# EasyEDA Pro project ProPrj_LogicCard.epro, schematic Schematic1
Board Name: Board1; Create Date: 2025-10-28; Page Name: LogicCard; Project Name: LogicCard; Schematic Name: Schematic1; Update Date: 2025-11-10; Company: annoyedmilk.ch; Drawn: Annoyedmilk; Page Size: A4; Version: V1.0
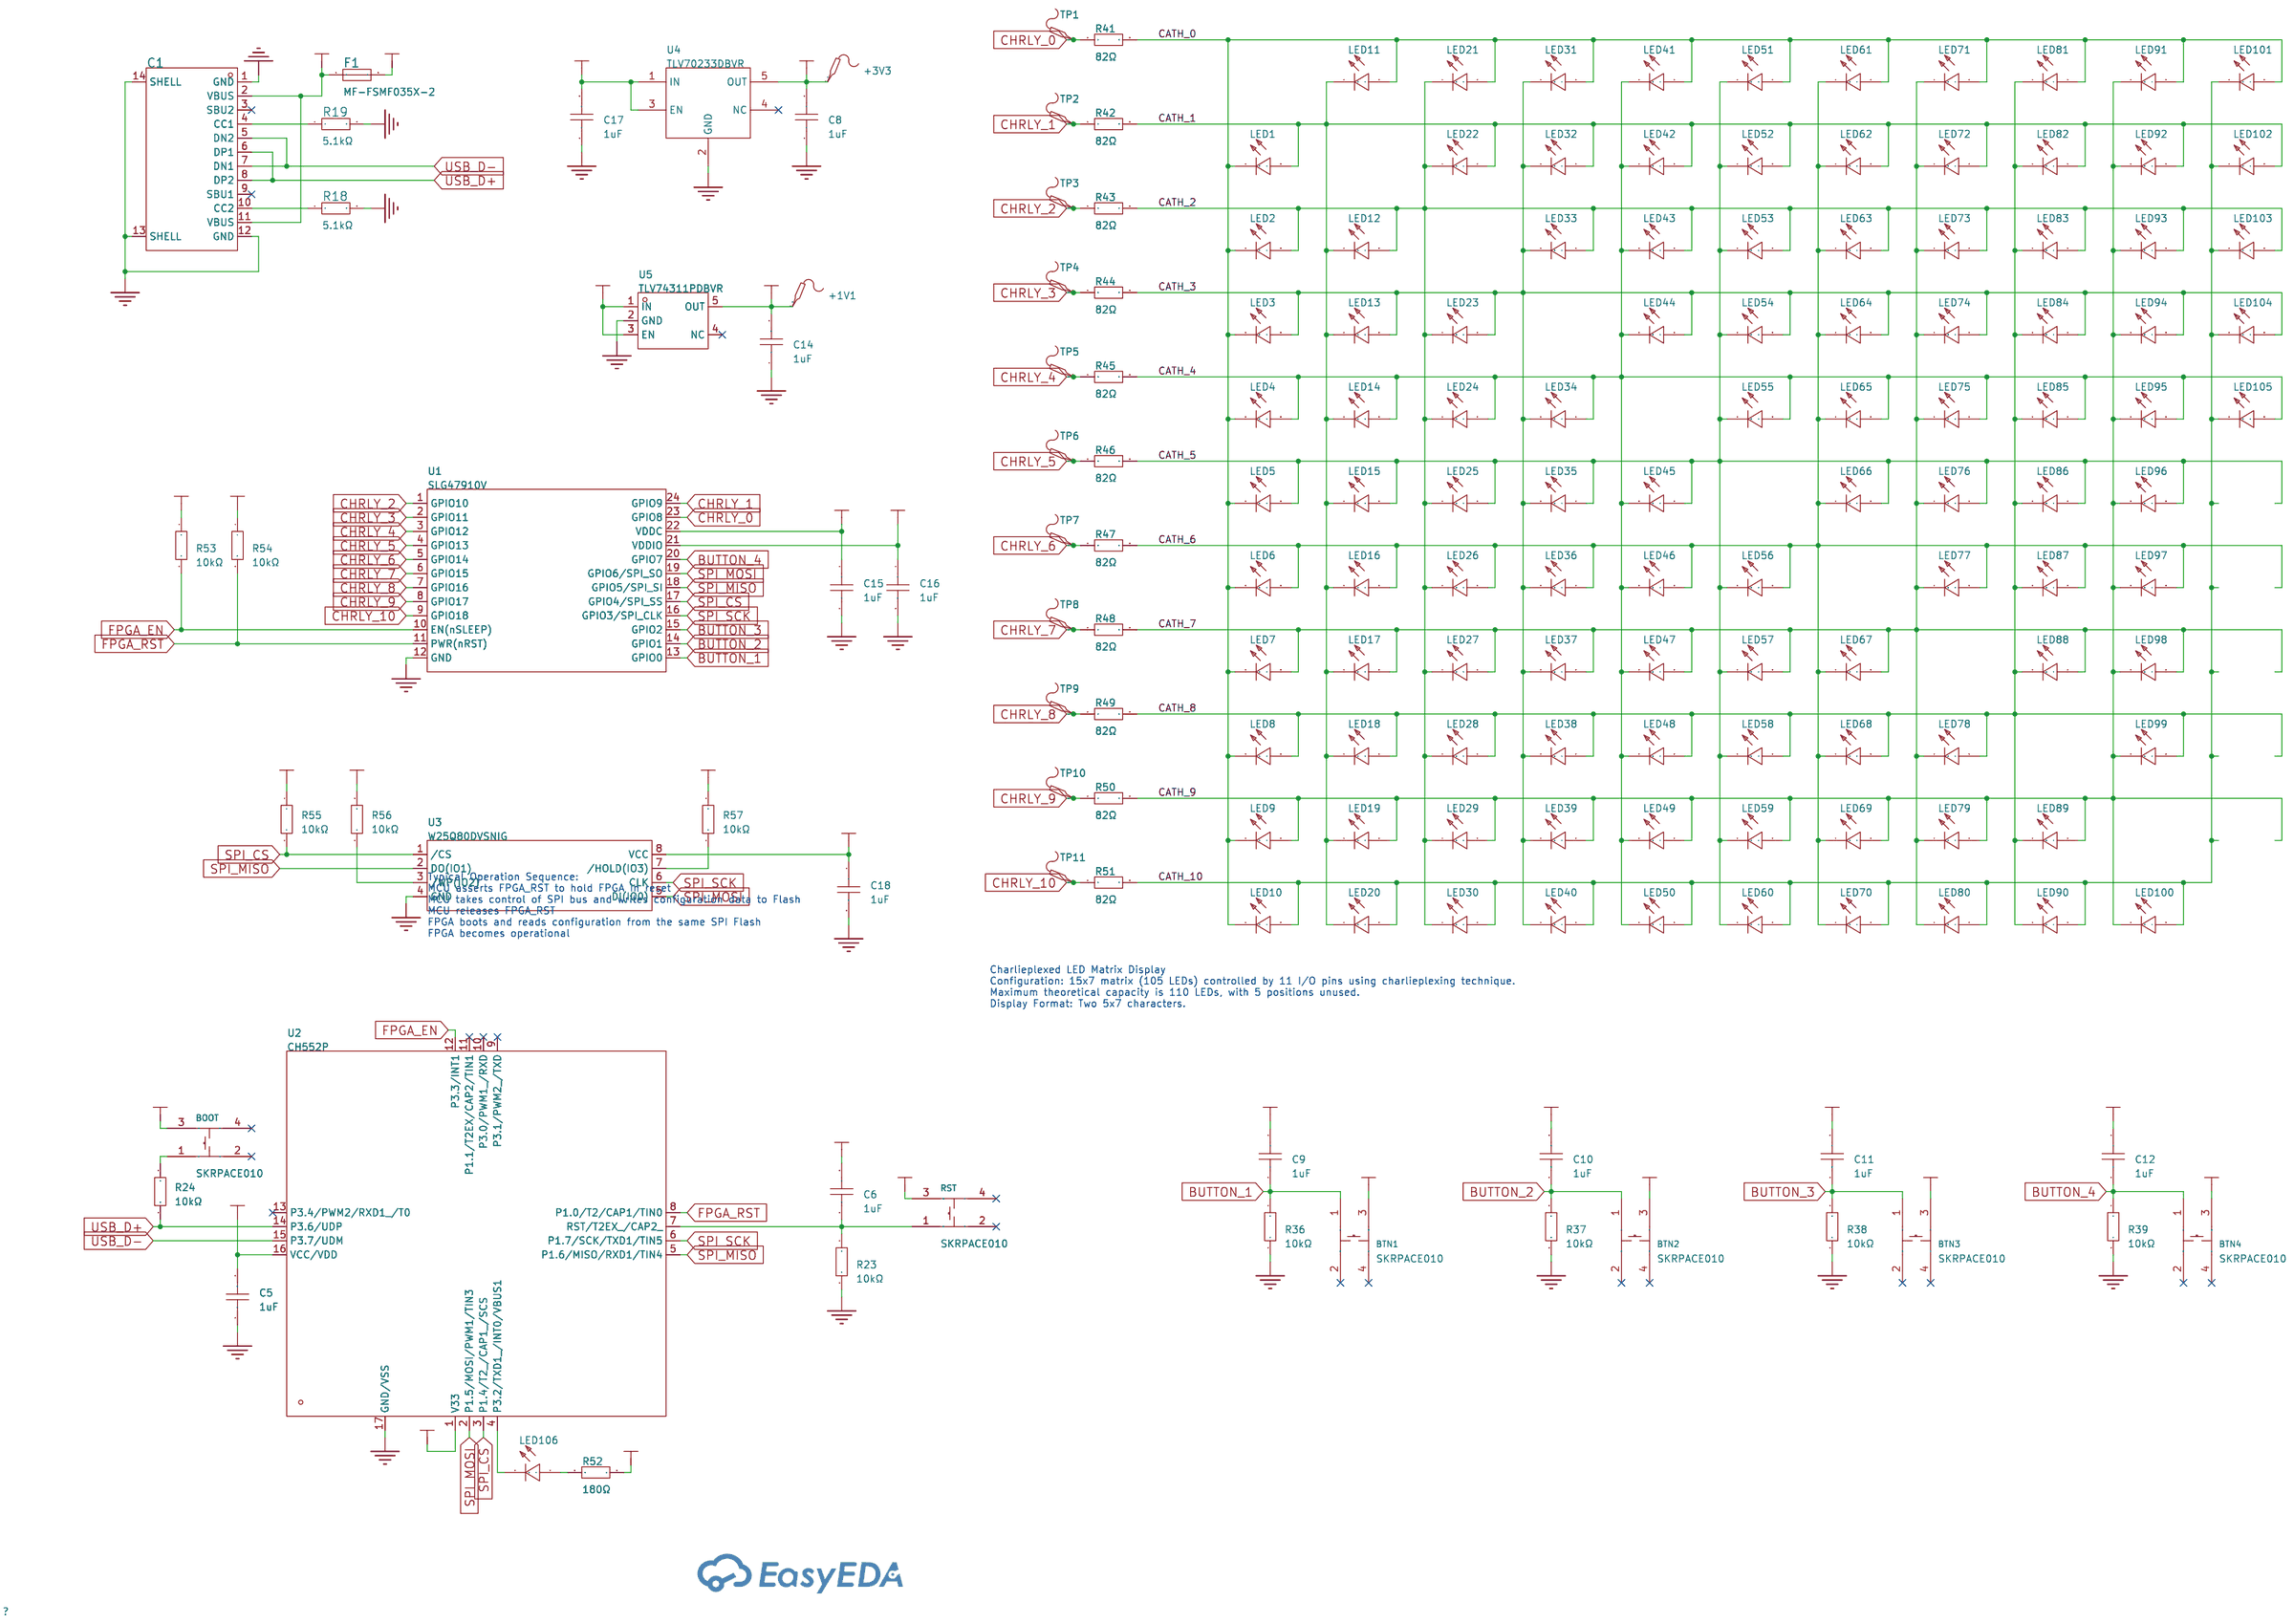
[diagram p0: schematic sheet]

## Parts
+1V1  -  [Test-Point-0.5mm]
+3V3  -  [Test-Point-0.5mm]
BOOT  SKRPACE010  [KEY-SMD_4P-L4.2-W3.2-P2.20-LS4.6]
BTN1  SKRPACE010  [KEY-SMD_4P-L4.2-W3.2-P2.20-LS4.6]
BTN2  SKRPACE010  [KEY-SMD_4P-L4.2-W3.2-P2.20-LS4.6]
BTN3  SKRPACE010  [KEY-SMD_4P-L4.2-W3.2-P2.20-LS4.6]
BTN4  SKRPACE010  [KEY-SMD_4P-L4.2-W3.2-P2.20-LS4.6]
C1  TYPE-C 16PIN 2MD(073)  [USB-C-SMD_TYPE-C-6PIN-2MD-073]
C5  1uF  [C0402]
C6  1uF  [C0402]
C8  1uF  [C0402]
C9  1uF  [C0402]
C10  1uF  [C0402]
C11  1uF  [C0402]
C12  1uF  [C0402]
C14  1uF  [C0402]
C15  1uF  [C0402]
C16  1uF  [C0402]
C17  1uF  [C0402]
C18  1uF  [C0402]
F1  MF-FSMF035X-2  [F0603]
LED1  19-213/Y2C-CQ2R2L/3T(CY)  [LED0603-RD-YELLOW]
LED2  19-213/Y2C-CQ2R2L/3T(CY)  [LED0603-RD-YELLOW]
LED3  19-213/Y2C-CQ2R2L/3T(CY)  [LED0603-RD-YELLOW]
LED4  19-213/Y2C-CQ2R2L/3T(CY)  [LED0603-RD-YELLOW]
LED5  19-213/Y2C-CQ2R2L/3T(CY)  [LED0603-RD-YELLOW]
LED6  19-213/Y2C-CQ2R2L/3T(CY)  [LED0603-RD-YELLOW]
LED7  19-213/Y2C-CQ2R2L/3T(CY)  [LED0603-RD-YELLOW]
LED8  19-213/Y2C-CQ2R2L/3T(CY)  [LED0603-RD-YELLOW]
LED9  19-213/Y2C-CQ2R2L/3T(CY)  [LED0603-RD-YELLOW]
LED10  19-213/Y2C-CQ2R2L/3T(CY)  [LED0603-RD-YELLOW]
LED11  19-213/Y2C-CQ2R2L/3T(CY)  [LED0603-RD-YELLOW]
LED12  19-213/Y2C-CQ2R2L/3T(CY)  [LED0603-RD-YELLOW]
LED13  19-213/Y2C-CQ2R2L/3T(CY)  [LED0603-RD-YELLOW]
LED14  19-213/Y2C-CQ2R2L/3T(CY)  [LED0603-RD-YELLOW]
LED15  19-213/Y2C-CQ2R2L/3T(CY)  [LED0603-RD-YELLOW]
LED16  19-213/Y2C-CQ2R2L/3T(CY)  [LED0603-RD-YELLOW]
LED17  19-213/Y2C-CQ2R2L/3T(CY)  [LED0603-RD-YELLOW]
LED18  19-213/Y2C-CQ2R2L/3T(CY)  [LED0603-RD-YELLOW]
LED19  19-213/Y2C-CQ2R2L/3T(CY)  [LED0603-RD-YELLOW]
LED20  19-213/Y2C-CQ2R2L/3T(CY)  [LED0603-RD-YELLOW]
LED21  19-213/Y2C-CQ2R2L/3T(CY)  [LED0603-RD-YELLOW]
LED22  19-213/Y2C-CQ2R2L/3T(CY)  [LED0603-RD-YELLOW]
LED23  19-213/Y2C-CQ2R2L/3T(CY)  [LED0603-RD-YELLOW]
LED24  19-213/Y2C-CQ2R2L/3T(CY)  [LED0603-RD-YELLOW]
LED25  19-213/Y2C-CQ2R2L/3T(CY)  [LED0603-RD-YELLOW]
LED26  19-213/Y2C-CQ2R2L/3T(CY)  [LED0603-RD-YELLOW]
LED27  19-213/Y2C-CQ2R2L/3T(CY)  [LED0603-RD-YELLOW]
LED28  19-213/Y2C-CQ2R2L/3T(CY)  [LED0603-RD-YELLOW]
LED29  19-213/Y2C-CQ2R2L/3T(CY)  [LED0603-RD-YELLOW]
LED30  19-213/Y2C-CQ2R2L/3T(CY)  [LED0603-RD-YELLOW]
LED31  19-213/Y2C-CQ2R2L/3T(CY)  [LED0603-RD-YELLOW]
LED32  19-213/Y2C-CQ2R2L/3T(CY)  [LED0603-RD-YELLOW]
LED33  19-213/Y2C-CQ2R2L/3T(CY)  [LED0603-RD-YELLOW]
LED34  19-213/Y2C-CQ2R2L/3T(CY)  [LED0603-RD-YELLOW]
LED35  19-213/Y2C-CQ2R2L/3T(CY)  [LED0603-RD-YELLOW]
LED36  19-213/Y2C-CQ2R2L/3T(CY)  [LED0603-RD-YELLOW]
LED37  19-213/Y2C-CQ2R2L/3T(CY)  [LED0603-RD-YELLOW]
LED38  19-213/Y2C-CQ2R2L/3T(CY)  [LED0603-RD-YELLOW]
LED39  19-213/Y2C-CQ2R2L/3T(CY)  [LED0603-RD-YELLOW]
LED40  19-213/Y2C-CQ2R2L/3T(CY)  [LED0603-RD-YELLOW]
LED41  19-213/Y2C-CQ2R2L/3T(CY)  [LED0603-RD-YELLOW]
LED42  19-213/Y2C-CQ2R2L/3T(CY)  [LED0603-RD-YELLOW]
LED43  19-213/Y2C-CQ2R2L/3T(CY)  [LED0603-RD-YELLOW]
LED44  19-213/Y2C-CQ2R2L/3T(CY)  [LED0603-RD-YELLOW]
LED45  19-213/Y2C-CQ2R2L/3T(CY)  [LED0603-RD-YELLOW]
LED46  19-213/Y2C-CQ2R2L/3T(CY)  [LED0603-RD-YELLOW]
LED47  19-213/Y2C-CQ2R2L/3T(CY)  [LED0603-RD-YELLOW]
LED48  19-213/Y2C-CQ2R2L/3T(CY)  [LED0603-RD-YELLOW]
LED49  19-213/Y2C-CQ2R2L/3T(CY)  [LED0603-RD-YELLOW]
LED50  19-213/Y2C-CQ2R2L/3T(CY)  [LED0603-RD-YELLOW]
LED51  19-213/Y2C-CQ2R2L/3T(CY)  [LED0603-RD-YELLOW]
LED52  19-213/Y2C-CQ2R2L/3T(CY)  [LED0603-RD-YELLOW]
LED53  19-213/Y2C-CQ2R2L/3T(CY)  [LED0603-RD-YELLOW]
LED54  19-213/Y2C-CQ2R2L/3T(CY)  [LED0603-RD-YELLOW]
LED55  19-213/Y2C-CQ2R2L/3T(CY)  [LED0603-RD-YELLOW]
LED56  19-213/Y2C-CQ2R2L/3T(CY)  [LED0603-RD-YELLOW]
LED57  19-213/Y2C-CQ2R2L/3T(CY)  [LED0603-RD-YELLOW]
LED58  19-213/Y2C-CQ2R2L/3T(CY)  [LED0603-RD-YELLOW]
LED59  19-213/Y2C-CQ2R2L/3T(CY)  [LED0603-RD-YELLOW]
LED60  19-213/Y2C-CQ2R2L/3T(CY)  [LED0603-RD-YELLOW]
LED61  19-213/Y2C-CQ2R2L/3T(CY)  [LED0603-RD-YELLOW]
LED62  19-213/Y2C-CQ2R2L/3T(CY)  [LED0603-RD-YELLOW]
LED63  19-213/Y2C-CQ2R2L/3T(CY)  [LED0603-RD-YELLOW]
LED64  19-213/Y2C-CQ2R2L/3T(CY)  [LED0603-RD-YELLOW]
LED65  19-213/Y2C-CQ2R2L/3T(CY)  [LED0603-RD-YELLOW]
LED66  19-213/Y2C-CQ2R2L/3T(CY)  [LED0603-RD-YELLOW]
LED67  19-213/Y2C-CQ2R2L/3T(CY)  [LED0603-RD-YELLOW]
LED68  19-213/Y2C-CQ2R2L/3T(CY)  [LED0603-RD-YELLOW]
LED69  19-213/Y2C-CQ2R2L/3T(CY)  [LED0603-RD-YELLOW]
LED70  19-213/Y2C-CQ2R2L/3T(CY)  [LED0603-RD-YELLOW]
LED71  19-213/Y2C-CQ2R2L/3T(CY)  [LED0603-RD-YELLOW]
LED72  19-213/Y2C-CQ2R2L/3T(CY)  [LED0603-RD-YELLOW]
LED73  19-213/Y2C-CQ2R2L/3T(CY)  [LED0603-RD-YELLOW]
LED74  19-213/Y2C-CQ2R2L/3T(CY)  [LED0603-RD-YELLOW]
LED75  19-213/Y2C-CQ2R2L/3T(CY)  [LED0603-RD-YELLOW]
LED76  19-213/Y2C-CQ2R2L/3T(CY)  [LED0603-RD-YELLOW]
LED77  19-213/Y2C-CQ2R2L/3T(CY)  [LED0603-RD-YELLOW]
LED78  19-213/Y2C-CQ2R2L/3T(CY)  [LED0603-RD-YELLOW]
LED79  19-213/Y2C-CQ2R2L/3T(CY)  [LED0603-RD-YELLOW]
LED80  19-213/Y2C-CQ2R2L/3T(CY)  [LED0603-RD-YELLOW]
LED81  19-213/Y2C-CQ2R2L/3T(CY)  [LED0603-RD-YELLOW]
LED82  19-213/Y2C-CQ2R2L/3T(CY)  [LED0603-RD-YELLOW]
LED83  19-213/Y2C-CQ2R2L/3T(CY)  [LED0603-RD-YELLOW]
LED84  19-213/Y2C-CQ2R2L/3T(CY)  [LED0603-RD-YELLOW]
LED85  19-213/Y2C-CQ2R2L/3T(CY)  [LED0603-RD-YELLOW]
LED86  19-213/Y2C-CQ2R2L/3T(CY)  [LED0603-RD-YELLOW]
LED87  19-213/Y2C-CQ2R2L/3T(CY)  [LED0603-RD-YELLOW]
LED88  19-213/Y2C-CQ2R2L/3T(CY)  [LED0603-RD-YELLOW]
LED89  19-213/Y2C-CQ2R2L/3T(CY)  [LED0603-RD-YELLOW]
LED90  19-213/Y2C-CQ2R2L/3T(CY)  [LED0603-RD-YELLOW]
LED91  19-213/Y2C-CQ2R2L/3T(CY)  [LED0603-RD-YELLOW]
LED92  19-213/Y2C-CQ2R2L/3T(CY)  [LED0603-RD-YELLOW]
LED93  19-213/Y2C-CQ2R2L/3T(CY)  [LED0603-RD-YELLOW]
LED94  19-213/Y2C-CQ2R2L/3T(CY)  [LED0603-RD-YELLOW]
LED95  19-213/Y2C-CQ2R2L/3T(CY)  [LED0603-RD-YELLOW]
LED96  19-213/Y2C-CQ2R2L/3T(CY)  [LED0603-RD-YELLOW]
LED97  19-213/Y2C-CQ2R2L/3T(CY)  [LED0603-RD-YELLOW]
LED98  19-213/Y2C-CQ2R2L/3T(CY)  [LED0603-RD-YELLOW]
LED99  19-213/Y2C-CQ2R2L/3T(CY)  [LED0603-RD-YELLOW]
LED100  19-213/Y2C-CQ2R2L/3T(CY)  [LED0603-RD-YELLOW]
LED101  19-213/Y2C-CQ2R2L/3T(CY)  [LED0603-RD-YELLOW]
LED102  19-213/Y2C-CQ2R2L/3T(CY)  [LED0603-RD-YELLOW]
LED103  19-213/Y2C-CQ2R2L/3T(CY)  [LED0603-RD-YELLOW]
LED104  19-213/Y2C-CQ2R2L/3T(CY)  [LED0603-RD-YELLOW]
LED105  19-213/Y2C-CQ2R2L/3T(CY)  [LED0603-RD-YELLOW]
LED106  19-213/Y2C-CQ2R2L/3T(CY)  [LED0603-RD-YELLOW]
R18  5.1kΩ  [R0402]
R19  5.1kΩ  [R0402]
R23  10kΩ  [R0402]
R24  10kΩ  [R0402]
R36  10kΩ  [R0402]
R37  10kΩ  [R0402]
R38  10kΩ  [R0402]
R39  10kΩ  [R0402]
R41  82Ω  [R0402]
R42  82Ω  [R0402]
R43  82Ω  [R0402]
R44  82Ω  [R0402]
R45  82Ω  [R0402]
R46  82Ω  [R0402]
R47  82Ω  [R0402]
R48  82Ω  [R0402]
R49  82Ω  [R0402]
R50  82Ω  [R0402]
R51  82Ω  [R0402]
R52  180Ω  [R0402]
R53  10kΩ  [R0402]
R54  10kΩ  [R0402]
R55  10kΩ  [R0402]
R56  10kΩ  [R0402]
R57  10kΩ  [R0402]
RST  SKRPACE010  [KEY-SMD_4P-L4.2-W3.2-P2.20-LS4.6]
TP1  -  [Test-Point-0.5mm]
TP2  -  [Test-Point-0.5mm]
TP3  -  [Test-Point-0.5mm]
TP4  -  [Test-Point-0.5mm]
TP5  -  [Test-Point-0.5mm]
TP6  -  [Test-Point-0.5mm]
TP7  -  [Test-Point-0.5mm]
TP8  -  [Test-Point-0.5mm]
TP9  -  [Test-Point-0.5mm]
TP10  -  [Test-Point-0.5mm]
TP11  -  [Test-Point-0.5mm]
U1  SLG47910V  [STQFN-24_L3.0-W3.0-P0.4_SLG47910V]
U2  CH552P  [VQFN-16_L3.0-W3.0-P0.50-BL-EP1.7]
U3  W25Q80DVSNIG  [SOIC-8_L4.9-W3.9-P1.27-LS6.0-BL]
U4  TLV70233DBVR  [SOT-23-5_L3.0-W1.7-P0.95-LS2.8-BR]
U5  TLV74311PDBVR  [SOT-23-5_L3.0-W1.7-P0.95-LS2.8-BL]

## Library data of the parts
+1V1 +3V3 TP1-TP11 = Test-Point: Test Point 测试点
BOOT BTN1-BTN4 RST = SKRPACE010: Circuit:SPST Actuator Style:Oval Button Mounting Type:Surface Mount,Vertical Length:4.2mm Width:3.2mm Switch Height:2.5mm Contact Current:50mA Voltage Rating:16V With Lamp:- Life:-; LCSC Part Name: 4.2*3.2*2.5mm 立贴 轻触开关; Supplier Part: C139797; Manufacturer: ALPSALPINE(阿尔卑斯阿尔派); Supplier Footprint: SMD-4P,4.2x3.2mm; JLCPCB Part Class: Extended Part; Datasheet: https://item.szlcsc.com/datasheet/SKRPACE010/151122.html; Supplier: LCSC; Circuit: SPST; Actuator Style: Oval Button; Mounting Type: Surface Mount,Vertical; Length: 4.2mm; Width: 3.2mm; Switch Height: 2.5mm; Contact Current: 50mA; Voltage Rating: 16V
C1 = TYPE-C 16PIN 2MD(073): Connector Type:Type-C Protocol Standard:- Gender:Female Mounting Type:Surface Mount, Right Angle Number of Contacts:16P Number of Ports:1 Current Rating-Power:3A Voltage Rating:5V Connect-Disconnect Life:5,000 Cycles Supplementary Features:- Center Height; LCSC Part Name: Type-C 母 卧贴; Supplier Part: C2765186; Manufacturer: SHOU HAN(首韩); Supplier Footprint: SMD; JLCPCB Part Class: Extended Part; Datasheet: https://item.szlcsc.com/datasheet/TYPE-C%252016PIN%25202MD(073)/2901843.html; Supplier: LCSC; Connector Type: Type-C; Gender: Female; Mounting Type: Surface Mount, Right Angle; Number of Contacts: 16P; Number of Ports: 1; Current Rating-Power: 3A; Voltage Rating: 5V; Connect-Disconnect Life: 5,000 Cycles; Detection color: Black; Operating Temperature: -25℃~+85℃
C5 C6 C8-C12 C14-C18 = GRM155Z71A105KE01D: Capacitance: Tolerance:±10% Tolerance:±10% Voltage Rating: Temperature Coefficient:; LCSC Part Name: 1uF ±10% 10V; Supplier Part: C528974; Manufacturer: muRata(村田); Supplier Footprint: 0402; JLCPCB Part Class: Extended Part; Datasheet: https://atta.szlcsc.com/upload/public/pdf/source/20200508/C528974_15BC5D9F0CC13FAE313D74FE55DE6D9B.pdf; Supplier: LCSC; Tolerance: ±10%
F1 = MF-FSMF035X-2: Voltage - Max:9V Current - Max:40A Hold Current:350mA Trip Current:750mA Power Dissipation:500mW Resistance - Initial (Ri) (Min):200mΩ Resistance - Post Trip (R1) (Max):1.4Ω Time to Trip(Max):100ms Operating Temperature:-40℃~+85℃ Operating Temperature:-40; LCSC Part Name: 6V 350mA 贴片自恢复; Supplier Part: C116602; Manufacturer: BOURNS; Supplier Footprint: 0603; JLCPCB Part Class: Extended Part; Datasheet: https://item.szlcsc.com/datasheet/MF-FSMF035X-2/117856.html; Supplier: LCSC; Voltage - Max: 9V; Current - Max: 40A; Hold Current: 350mA; Trip Current: 750mA; Power Dissipation: 500mW; Resistance - Initial (Ri) (Min): 200mΩ; Resistance - Post Trip (R1) (Max): 1.4Ω; Time to Trip(Max): 100ms; Operating Temperature: -40℃~+85℃; Length: 1.85mm; Width: 1.05mm; Height: 0.65mm
LED1-LED106 = 19-213/Y2C-CQ2R2L/3T(CY): Illumination Color:Yellow Power(Watts):60mW Forward Current:20mA Wavelength - Dominant:585.5nm~591.5nm Wavelength - Dominant:585.5nm~591.5nm Peak Wavelength:591nm Diode Configuration:- Lens Color:Water Clear Color Temperature:- Color Temperature:- Viewing; LCSC Part Name: 黄灯; Supplier Part: C72038; Manufacturer: EVERLIGHT(亿光); Supplier Footprint: 0603; JLCPCB Part Class: Extended Part; Supplier: LCSC; Illumination Color: Yellow; Power(Watts): 60mW; Forward Current: 20mA; Wavelength - Dominant: 585.5nm~591.5nm; Peak Wavelength: 591nm; Lens Color: Water Clear; Viewing Angle: 120°; Operating Temperature: -40℃~+85℃
R18 R19 = RC0402JR-075K1L: Type:Thick Film Resistor Resistance:5.1kΩ Tolerance:±5% Tolerance:±5% Power(Watts):62.5mW Voltage-Supply(Max):50V Temperature Coefficient:±100ppm/℃ Temperature Coefficient:±100ppm/℃ Operating Temperature:-55℃~+155℃ Operating Temperature:-55℃~+155℃; LCSC Part Name: 厚膜电阻 5.1kΩ ±5% 62.5mW; Supplier Part: C105873; Manufacturer: YAGEO(国巨); Supplier Footprint: 0402; JLCPCB Part Class: Extended Part; Datasheet: https://item.szlcsc.com/datasheet/RC0402JR-075K1L/107088.html; Supplier: LCSC; Type: Thick Film Resistor; Tolerance: ±5%; Power(Watts): 62.5mW; Voltage-Supply(Max): 50V; Temperature Coefficient: ±100ppm/℃; Operating Temperature: -55℃~+155℃
R23 R24 R36-R39 R53-R57 = RC0402FR-0710KL: Type:Thick Film Resistor Resistance:10kΩ Tolerance:±1% Tolerance:±1% Power(Watts):62.5mW Voltage-Supply(Max):50V Temperature Coefficient:±100ppm/℃ Temperature Coefficient:±100ppm/℃ Operating Temperature:-55℃~+155℃ Operating Temperature:-55℃~+155℃; LCSC Part Name: 厚膜电阻 10kΩ ±1% 62.5mW; Supplier Part: C60490; Manufacturer: YAGEO(国巨); Supplier Footprint: 0402; JLCPCB Part Class: Extended Part; Datasheet: https://item.szlcsc.com/datasheet/RC0402FR-0710KL/61542.html; Supplier: LCSC; Type: Thick Film Resistor; Tolerance: ±1%; Power(Watts): 62.5mW; Voltage-Supply(Max): 50V; Temperature Coefficient: ±100ppm/℃; Operating Temperature: -55℃~+155℃
R41-R51 = RC0402FR-0782RL: Type:Thick Film Resistors Resistance: Tolerance:±1% Tolerance:±1% Power(Watts): Overload Voltage (Max): Temperature Coefficient:±100ppm/℃ Temperature Coefficient:±100ppm/℃ Operating Temperature Range:-55℃~+155℃ Operating Temperature Range:-55℃~+155℃; LCSC Part Name: 厚膜电阻 82Ω ±1% 62.5mW; Supplier Part: C163453; Manufacturer: YAGEO(国巨); Supplier Footprint: 0402; JLCPCB Part Class: Extended Part; Datasheet: https://atta.szlcsc.com/upload/public/pdf/source/20181009/C309620_DA5935B6E1D48212CB7A533FE518B3C2.pdf; Supplier: LCSC; Type: Thick Film Resistors; Tolerance: ±1%; Temperature Coefficient: ±100ppm/℃; Operating Temperature Range: -55℃~+155℃
R52 = RC0402FR-07180RL: Type:Thick Film Resistor Resistance:180Ω Tolerance:±1% Tolerance:±1% Power(Watts):62.5mW Voltage-Supply(Max):50V Temperature Coefficient:±100ppm/℃ Temperature Coefficient:±100ppm/℃ Operating Temperature:-55℃~+155℃ Operating Temperature:-55℃~+155℃; LCSC Part Name: 厚膜电阻 180Ω ±1% 62.5mW; Supplier Part: C138045; Manufacturer: YAGEO(国巨); Supplier Footprint: 0402; JLCPCB Part Class: Extended Part; Datasheet: https://item.szlcsc.com/datasheet/RC0402FR-07180RL/149361.html; Supplier: LCSC; Type: Thick Film Resistor; Tolerance: ±1%; Power(Watts): 62.5mW; Voltage-Supply(Max): 50V; Temperature Coefficient: ±100ppm/℃; Operating Temperature: -55℃~+155℃
U1 = SLG47910V: Supplier Part: C9900234634; Supplier Footprint: STQFN-24; Supplier: LCSC
U2 = CH552P: Supplier Part: C968536; Manufacturer: WCH(南京沁恒); Supplier Footprint: QFN-16; JLCPCB Part Class: Extended Part; Datasheet: https://atta.szlcsc.com/upload/public/pdf/source/20200819/C111292_2988E0DDEDF937C7B5A075A68BF2AC9C.pdf; Supplier: LCSC
U3 = W25Q80DVSNIG: Interface:SPI Memory Size:8Mbit Clock Frequency:104MHz Voltage - Supply:2.7V~3.6V Voltage - Supply:2.7V~3.6V Standby Supply Current:10uA Program / Erase Cycles:100,000 Cycles Page Programming Time (Tpp):3ms Data Retention - TDR (Year):20 Years Operating T; LCSC Part Name: 支持双路和四路SPI接口的2.5V和3V、8Mbit 串行SPI闪存; Supplier Part: C115408; Manufacturer: Winbond(华邦); Supplier Footprint: SOIC-8; JLCPCB Part Class: Extended Part; Datasheet: https://item.szlcsc.com/datasheet/W25Q80DVSNIG/116656.html; Supplier: LCSC; Interface: SPI; Memory Size: 8Mbit; Clock Frequency: 104MHz; Voltage - Supply: 2.7V~3.6V; Standby Supply Current: 10uA; Program / Erase Cycles: 100,000 Cycles; Page Programming Time (Tpp): 3ms; Data Retention - TDR (Year): 20 Years
U4 = TLV70233DBVR: Output Type:Fixed Voltage - Supply:5.5V Output Voltage:3.3V Output Voltage:3.3V Output Current:300mA Power Supply Rejection Ratio (PSRR):68dB@(1kHz) Voltage Dropout:375mV@(300mA) standby current:35uA Noise:48uVrms Features:Over Temperature Protection；Over; LCSC Part Name: 具有使能功能的 300mA、高 PSRR、低 IQ、低压降稳压器; Supplier Part: C26833; Manufacturer: TI(德州仪器); Supplier Footprint: SOT-23-5; JLCPCB Part Class: Extended Part; Datasheet: https://www.ti.com/cn/lit/gpn/tlv702; Supplier: LCSC; Output Type: Fixed; Voltage - Supply: 5.5V; Output Voltage: 3.3V; Output Current: 300mA; Power Supply Rejection Ratio (PSRR): 68dB@(1kHz); Voltage Dropout: 375mV@(300mA); standby current: 35uA; Noise: 48uVrms; Features: Over Temperature Protection；Over Current Protection; Operating Temperature: -40℃~+125℃@(Tj); Output Configuration: Positive; Number of Outputs: 1
U5 = TLV74311PDBVR: Output Type:Fixed Maximum Input Voltage:5.5V Output Voltage:1.1V Output Voltage:1.1V Output Current:300mA Dropout Voltage:480mV@(300mA) standby current:60uA Feature:ESD Protection；Low ESR；Thermal Protection(TSD)；Under-voltage Lockout；Overcurrent Protectio; LCSC Part Name: 具有使能功能的 300mA、低 IQ、低压降稳压器; Supplier Part: C485147; Manufacturer: TI(德州仪器); Supplier Footprint: SOT-23-5; JLCPCB Part Class: Extended Part; Datasheet: https://www.ti.com/cn/lit/gpn/tlv743p; Supplier: LCSC; Output Type: Fixed; Maximum Input Voltage: 5.5V; Output Voltage: 1.1V; Output Current: 300mA; Dropout Voltage: 480mV@(300mA); standby current: 60uA; Feature: ESD Protection；Low ESR；Thermal Protection(TSD)；Under-voltage Lockout；Overcurrent Protection(OCP)；With ability; Operating Temperature: -40℃~+125℃@(Tj); Output Polarity: Positive electrode; Number of Outputs: 1

## Nets
+1V1: +1V1.1 C14.2 C15.1 U1.22(VDDC) U5.5(OUT)
+3V3: +3V3.1 BOOT.3 BTN1.3 BTN2.3 BTN3.3 BTN4.3 C5.2 C6.2 C8.2 C9.2 C10.2 C11.2 C12.2 C16.1 C18.1 R52.2 R53.1 R54.1 R55.1 R56.1 R57.1 RST.3 U1.21(VDDIO) U2.1(V33) U2.16(VCC/VDD) U3.8(VCC) U4.5(OUT) U5.1(IN) U5.3(EN)
GND: C1.1(GND) C1.12(GND) C1.13(SHELL) C1.14(SHELL) C5.1 C8.1 C14.1 C15.2 C16.2 C17.1 C18.2 R18.2 R19.2 R23.2 R36.2 R37.2 R38.2 R39.2 U1.12(GND) U2.17(GND/VSS) U3.4(GND) U4.2(GND) U5.2(GND)
VBUS: C1.2(VBUS) C1.11(VBUS) F1.1
VIN: C17.2 F1.2 U4.1(IN) U4.3(EN)
BUTTON_1: BTN1.1 C9.1 R36.1 U1.13(GPIO0)
BUTTON_2: BTN2.1 C10.1 R37.1 U1.14(GPIO1)
BUTTON_3: BTN3.1 C11.1 R38.1 U1.15(GPIO2)
BUTTON_4: BTN4.1 C12.1 R39.1 U1.20(GPIO7)
CATH_0: LED1.1(C) LED2.1(C) LED3.1(C) LED4.1(C) LED5.1(C) LED6.1(C) LED7.1(C) LED8.1(C) LED9.1(C) LED10.1(C) LED11.2(A) LED21.2(A) LED31.2(A) LED41.2(A) LED51.2(A) LED61.2(A) LED71.2(A) LED81.2(A) LED91.2(A) LED101.2(A) R41.2
CATH_1: LED1.2(A) LED11.1(C) LED12.1(C) LED13.1(C) LED14.1(C) LED15.1(C) LED16.1(C) LED17.1(C) LED18.1(C) LED19.1(C) LED20.1(C) LED22.2(A) LED32.2(A) LED42.2(A) LED52.2(A) LED62.2(A) LED72.2(A) LED82.2(A) LED92.2(A) LED102.2(A) R42.2
CATH_2: LED2.2(A) LED12.2(A) LED21.1(C) LED22.1(C) LED23.1(C) LED24.1(C) LED25.1(C) LED26.1(C) LED27.1(C) LED28.1(C) LED29.1(C) LED30.1(C) LED33.2(A) LED43.2(A) LED53.2(A) LED63.2(A) LED73.2(A) LED83.2(A) LED93.2(A) LED103.2(A) R43.2
CATH_3: LED3.2(A) LED13.2(A) LED23.2(A) LED31.1(C) LED32.1(C) LED33.1(C) LED34.1(C) LED35.1(C) LED36.1(C) LED37.1(C) LED38.1(C) LED39.1(C) LED40.1(C) LED44.2(A) LED54.2(A) LED64.2(A) LED74.2(A) LED84.2(A) LED94.2(A) LED104.2(A) R44.2
CATH_4: LED4.2(A) LED14.2(A) LED24.2(A) LED34.2(A) LED41.1(C) LED42.1(C) LED43.1(C) LED44.1(C) LED45.1(C) LED46.1(C) LED47.1(C) LED48.1(C) LED49.1(C) LED50.1(C) LED55.2(A) LED65.2(A) LED75.2(A) LED85.2(A) LED95.2(A) LED105.2(A) R45.2
CATH_5: LED5.2(A) LED15.2(A) LED25.2(A) LED35.2(A) LED45.2(A) LED51.1(C) LED52.1(C) LED53.1(C) LED54.1(C) LED55.1(C) LED56.1(C) LED57.1(C) LED58.1(C) LED59.1(C) LED60.1(C) LED66.2(A) LED76.2(A) LED86.2(A) LED96.2(A) R46.2
CATH_6: LED6.2(A) LED16.2(A) LED26.2(A) LED36.2(A) LED46.2(A) LED56.2(A) LED61.1(C) LED62.1(C) LED63.1(C) LED64.1(C) LED65.1(C) LED66.1(C) LED67.1(C) LED68.1(C) LED69.1(C) LED70.1(C) LED77.2(A) LED87.2(A) LED97.2(A) R47.2
CATH_7: LED7.2(A) LED17.2(A) LED27.2(A) LED37.2(A) LED47.2(A) LED57.2(A) LED67.2(A) LED71.1(C) LED72.1(C) LED73.1(C) LED74.1(C) LED75.1(C) LED76.1(C) LED77.1(C) LED78.1(C) LED79.1(C) LED80.1(C) LED88.2(A) LED98.2(A) R48.2
CATH_8: LED8.2(A) LED18.2(A) LED28.2(A) LED38.2(A) LED48.2(A) LED58.2(A) LED68.2(A) LED78.2(A) LED81.1(C) LED82.1(C) LED83.1(C) LED84.1(C) LED85.1(C) LED86.1(C) LED87.1(C) LED88.1(C) LED89.1(C) LED90.1(C) LED99.2(A) R49.2
CATH_9: LED9.2(A) LED19.2(A) LED29.2(A) LED39.2(A) LED49.2(A) LED59.2(A) LED69.2(A) LED79.2(A) LED89.2(A) LED91.1(C) LED92.1(C) LED93.1(C) LED94.1(C) LED95.1(C) LED96.1(C) LED97.1(C) LED98.1(C) LED99.1(C) LED100.1(C) R50.2
CATH_10: LED10.2(A) LED20.2(A) LED30.2(A) LED40.2(A) LED50.2(A) LED60.2(A) LED70.2(A) LED80.2(A) LED90.2(A) LED100.2(A) LED101.1(C) LED102.1(C) LED103.1(C) LED104.1(C) LED105.1(C) R51.2
CHRLY_0: R41.1 TP1.1 U1.23(GPIO8)
CHRLY_1: R42.1 TP2.1 U1.24(GPIO9)
CHRLY_2: R43.1 TP3.1 U1.1(GPIO10)
CHRLY_3: R44.1 TP4.1 U1.2(GPIO11)
CHRLY_4: R45.1 TP5.1 U1.3(GPIO12)
CHRLY_5: R46.1 TP6.1 U1.4(GPIO13)
CHRLY_6: R47.1 TP7.1 U1.5(GPIO14)
CHRLY_7: R48.1 TP8.1 U1.6(GPIO15)
CHRLY_8: R49.1 TP9.1 U1.7(GPIO16)
CHRLY_9: R50.1 TP10.1 U1.8(GPIO17)
CHRLY_10: R51.1 TP11.1 U1.9(GPIO18)
FPGA_EN: R53.2 U1.10(EN(nSLEEP)) U2.12(P3.3/INT1)
FPGA_RST: R54.2 U1.11(PWR(nRST)) U2.8(P1.0/T2/CAP1/TIN0)
SPI_CS: R55.2 U1.17(GPIO4/SPI_SS) U2.3(P1.4/T2_/CAP1_/SCS) U3.1(/CS)
SPI_MISO: U1.18(GPIO5/SPI_SI) U2.5(P1.6/MISO/RXD1/TIN4) U3.2(DO(IO1))
SPI_MOSI: U1.19(GPIO6/SPI_SO) U2.2(P1.5/MOSI/PWM1/TIN3) U3.5(DI(IO0))
SPI_SCK: U1.16(GPIO3/SPI_CLK) U2.6(P1.7/SCK/TXD1/TIN5) U3.6(CLK)
USB_D+: C1.6(DP1) C1.8(DP2) R24.2 U2.14(P3.6/UDP)
USB_D-: C1.5(DN2) C1.7(DN1) U2.15(P3.7/UDM)
$1N623: C1.10(CC2) R18.1
$1N632: C1.4(CC1) R19.1
$1N2896: BOOT.1 R24.1
$1N3149: C6.1 R23.1 RST.1 U2.7(RST/T2EX_/CAP2_)
$1N19196: R57.2 U3.7(/HOLD(IO3))
$1N19224: R56.2 U3.3(/WP(IO2))
$1N40380: LED106.1(C) U2.4(P3.2/TXD1_/INT0/VBUS1)
$1N40391: LED106.2(A) R52.1

Not connected (* = marked no-connect by the designer): BOOT 2* 4*; BTN1 2* 4*; BTN2 2* 4*; BTN3 2* 4*; BTN4 2* 4*; C1 3(SBU2)* 9(SBU1)*; RST 2* 4*; U2 9(P3.1/PWM2_/TXD)* 10(P3.0/PWM1_/RXD)* 11(P1.1/T2EX/CAP2/TIN1)* 13(P3.4/PWM2/RXD1_/T0)*; U4 4(NC)*; U5 4(NC)*

## Notes on the sheet
- Typical Operation Sequence:
  MCU asserts FPGA_RST to hold FPGA in reset
  MCU takes control of SPI bus and writes configuration data to Flash
  MCU releases FPGA_RST
  FPGA boots and reads configuration from the same SPI Flash
  FPGA becomes operational
- Charlieplexed LED Matrix Display
  Configuration: 15x7 matrix (105 LEDs) controlled by 11 I/O pins using charlieplexing technique.
  Maximum theoretical capacity is 110 LEDs, with 5 positions unused.
  Display Format: Two 5x7 characters.
